# EAGLE design protection1 (EAGLE 5.11)
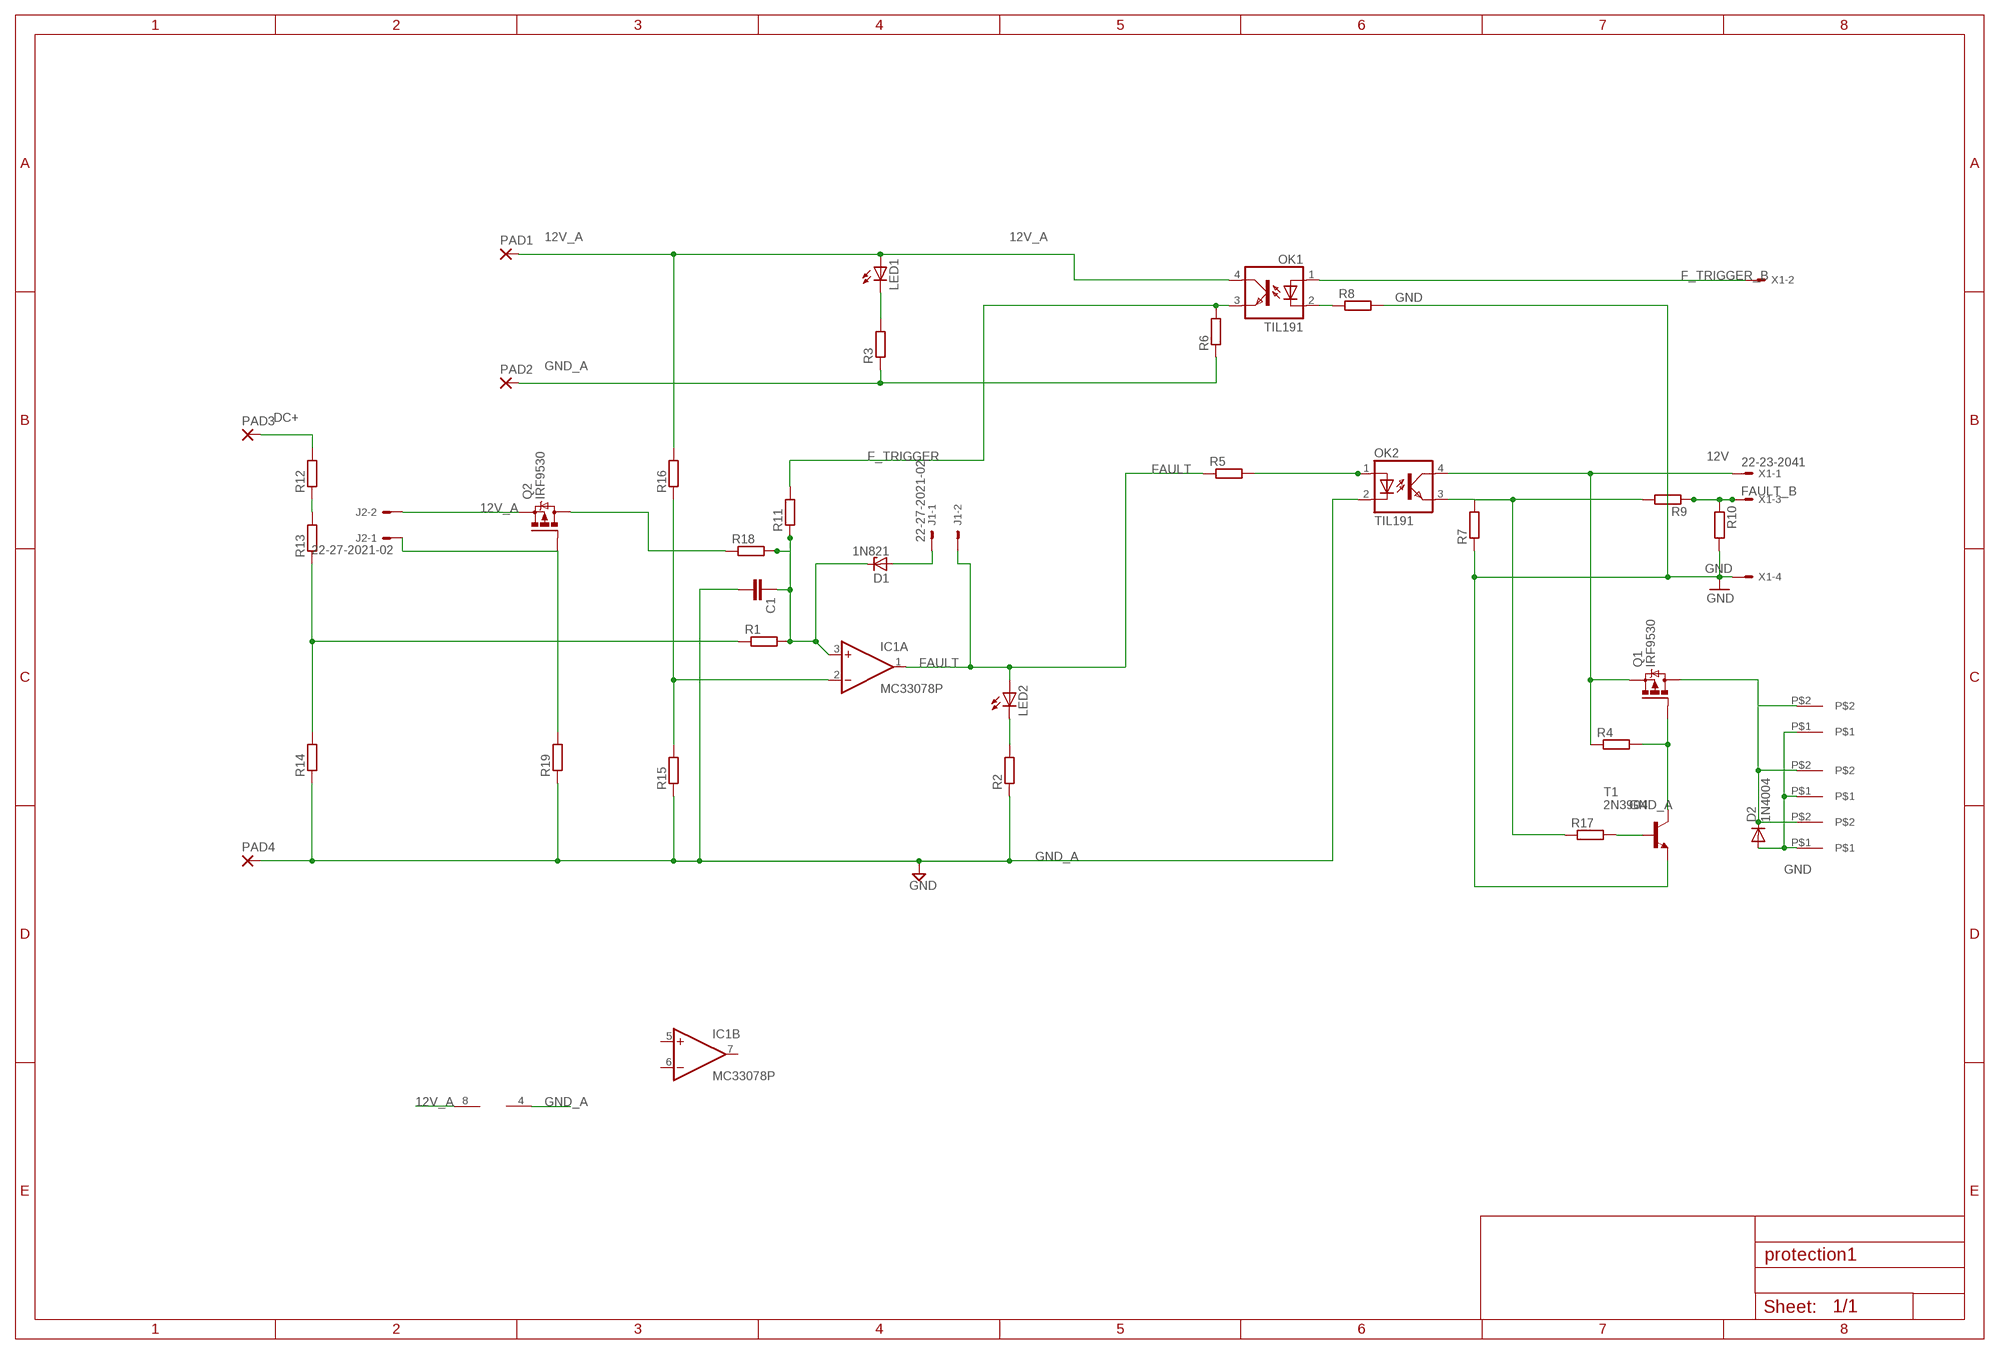
[diagram p0: schematic, sheet 1]

## Parts
C1  C2.5/2  [C2.5-2]
D1  1N821  [DO35Z10]
D2  1N4004  [DO41-10]
IC1  MC33078P  [DIL08]
J1  22-27-2021-02  [6410-02]
J2  22-27-2021-02  [6410-02]
LED1  LEDP-LCC-2  [P-LCC-2]
LED2  LEDP-LCC-2  [P-LCC-2]
OK1  TIL191  [DIL04]
OK2  TIL191  [DIL04]
PAD1  2,54/1,0  [2,54/1,0]
PAD2  2,54/1,0  [2,54/1,0]
PAD3  3,81/1,4  [3,81/1,4]
PAD4  3,81/1,4  [3,81/1,4]
Q1  IRF9530  [TO220BV]
Q2  IRF9530  [TO220BV]
R1  R-EU_0207/10  [0207/10]
R2  R-EU_0207/10  [0207/10]
R3  R-EU_0207/10  [0207/10]
R4  R-EU_0207/10  [0207/10]
R5  R-EU_0207/10  [0207/10]
R6  R-EU_0207/10  [0207/10]
R7  R-EU_0207/10  [0207/10]
R8  R-EU_0207/10  [0207/10]
R9  R-EU_0207/10  [0207/10]
R10  R-EU_0207/10  [0207/10]
R11  R-EU_0207/10  [0207/10]
R12  R-EU_0411/12  [0411/12]
R13  R-EU_0411/12  [0411/12]
R14  R-EU_0207/10  [0207/10]
R15  R-EU_0207/10  [0207/10]
R16  R-EU_0207/10  [0207/10]
R17  R-EU_0207/10  [0207/10]
R18  R-EU_0207/10  [0207/10]
R19  R-EU_0207/10  [0207/10]
T1  2N3904  [TO92]
U$1  TERMINAL_2WAY_EESTORES  [TERMINAL_2WAY_EESTORES]
U$2  TERMINAL_2WAY_EESTORES  [TERMINAL_2WAY_EESTORES]
U$3  TERMINAL_2WAY_EESTORES  [TERMINAL_2WAY_EESTORES]
X1  22-23-2041  [22-23-2041]

## Nets
12V: OK2.4(COL) Q1.S R4.1 X1.1
12V_A: IC1.8(P:V+) J2.2 LED1.A OK1.4(COL) PAD1.1(P) Q2.S R16.2
DC+: PAD3.1(P) R12.2
F_TRIGGER: OK1.3(EMIT) R6.2 R11.2
F_TRIGGER_B: OK1.1(A) X1.2
FAULT: IC1.1(A:OUT) J1.2 LED2.A R5.1
FAULT_B: OK2.3(EMIT) R7.2 R9.2 R17.1
GND: D2.A R7.1 R8.2 R10.2 T1.3(E) U$1.P$1 U$2.P$1 U$3.P$1 X1.4
GND_A: C1.2 IC1.4(P:V-) OK2.2(C) PAD2.1(P) PAD4.1(P) R2.1 R3.1 R6.1 R14.1 R15.1 R19.1 ; supply symbol labelled GND
N$1: OK2.1(A) R5.2
N$2: C1.1 D1.C IC1.3(A:+IN) R1.2 R11.1 R18.2
N$3: LED2.C R2.2
N$4: Q1.G R4.2 T1.1(C)
N$5: IC1.2(A:-IN) R15.2 R16.1
N$6: R17.2 T1.2(B)
N$7: R1.1 R13.1 R14.2
N$8: LED1.C R3.2
N$9: R12.1 R13.2
N$10: D2.C Q1.D U$1.P$2 U$2.P$2 U$3.P$2
N$11: OK1.2(C) R8.1
N$14: R9.1 R10.1 X1.3
N$15: D1.A J1.1
N$16: Q2.D R18.1
N$17: J2.1 Q2.G R19.2
Unconnected: IC1.5(B:+IN) IC1.6(B:-IN) IC1.7(B:OUT)

## Library data of the parts
C1 = capacitor-wima:C: CAPACITOR naming: grid - package width
D1 = diode:1N821: Reference DIODE temperature compensated, 6,2 V
D2 = diode:1N4004: DIODE general purpose rectifier, 1 A
IC1 = linear:MC33078: OP AMP
J1 J2 = con-molex:22-?-02: CONNECTOR wire to board 2.54 mm (.1 inch) pitch header; OC_FARNELL: unknown; OC_NEWARK: unknown
LED1 LED2 = led:LED: LED OSRAM: - CHIPLED LG R971, LG N971, LY N971, LG Q971, LY Q971, LO R971, LY R971 LH N974, LH R974 LS Q976, LO Q976, LY Q976 LO Q996 - Hyper CHIPLED LW Q18S LB Q993, LB Q99A, LB R99A - SideLED LS A670, LO A670, LY A670, LG A670, LP A670 LB A673, LV A673, LT A673, LW A673 LH A674 LY A675 LS A676, LA A676, LO A676, LY A676, LW A676 LS A679, LY A679, LG A679 - Hyper Micro SIDELED® LS Y876, LA Y876, LO Y876, LY Y876 LT Y87S - SmartLED LW L88C, LW L88S LB L89C, LB L89S, LG L890 LS L89K, LO L89K, LY L89K LS L896, LA L896, LO L896, LY L896 - TOPLED LS T670, LO T670, LY T670, LG T670, LP T670 LSG T670, LSP T670, LSY T670, LOP T670, LYG T670 LG T671, LOG T671, LSG T671 LB T673, LV T673, LT T673, LW T673 LH T674 LS T676, LA T676, LO T676, LY T676, LB T676, LH T676, LSB T676, LW T676 LB T67C, LV T67C, LT T67C, LS T67K, LO T67K, LY T67K, LW E67C LS E67B, LA E67B, LO E67B, LY E67B, LB E67C, LV E67C, LT E67C LW T67C LS T679, LY T679, LG T679 LS T770, LO T770, LY T770, LG T770, LP T770 LB T773, LV T773, LT T773, LW T773 LH T774 LS E675, LA E675, LY E675, LS T675 LS T776, LA T776, LO T776, LY T776, LB T776 LHGB T686 LT T68C, LB T68C - Hyper Mini TOPLED® LB M676 - Mini TOPLED Santana® LG M470 LS M47K, LO M47K, LY M47K Source: http://www.osram.convergy.de LUXEON: - LUMILED® LXK2-PW12-R00, LXK2-PW12-S00, LXK2-PW14-U00, LXK2-PW14-V00 LXK2-PM12-R00, LXK2-PM12-S00, LXK2-PM14-U00 LXK2-PE12-Q00, LXK2-PE12-R00, LXK2-PE12-S00, LXK2-PE14-T00, LXK2-PE14-U00 LXK2-PB12-K00, LXK2-PB12-L00, LXK2-PB12-M00, LXK2-PB14-N00, LXK2-PB14-P00, LXK2-PB14-Q00 LXK2-PR12-L00, LXK2-PR12-M00, LXK2-PR14-Q00, LXK2-PR14-R00 LXK2-PD12-Q00, LXK2-PD12-R00, LXK2-PD12-S00 LXK2-PH12-R00, LXK2-PH12-S00 LXK2-PL12-P00, LXK2-PL12-Q00, LXK2-PL12-R00 Source: www.luxeon.com KINGBRIGHT: KA-3528ASYC Source: www.kingbright.com
OK1 OK2 = optocoupler:TIL191: TEXAS INSTRUMENTS OPTO COUPLER; OC_FARNELL: 1683363; OC_NEWARK: unknown
PAD1 PAD2 = wirepad:2,54/1,0: THROUGH-HOLE PAD
PAD3 PAD4 = wirepad:3,81/1,4: THROUGH-HOLE PAD
Q1 Q2 = transistor-power:IRF9530: P-CHANNEL HEXFET POWER-MOS-FET Source: http://www.irf.com/product-info/datasheets/data/irf9530.pdf
R1-R19 = resistor:R-EU_: RESISTOR, European symbol
T1 = transistor:2N3904: NPN TRANSISTOR
U$1-U$3 = 3ygp:TERMINAL_2WAY_EESTORES
X1 = con-molex:22-23-2041: .100" (2.54mm) Center Header - 4 Pin; MF: MOLEX; MPN: 22-23-2041; OC_FARNELL: 1462920; OC_NEWARK: 38C0355

## Board
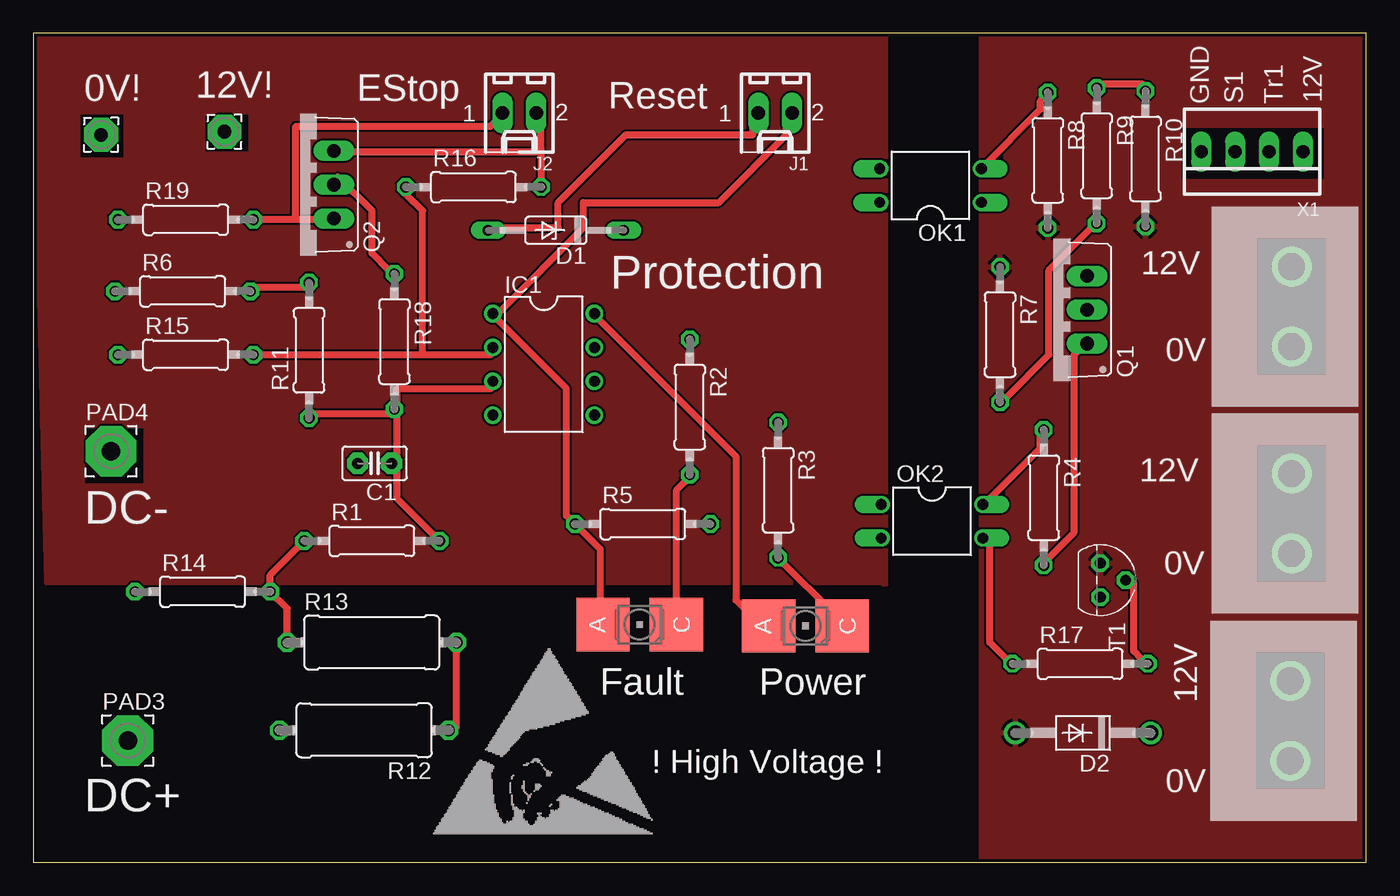
[diagram p1: board, top side]
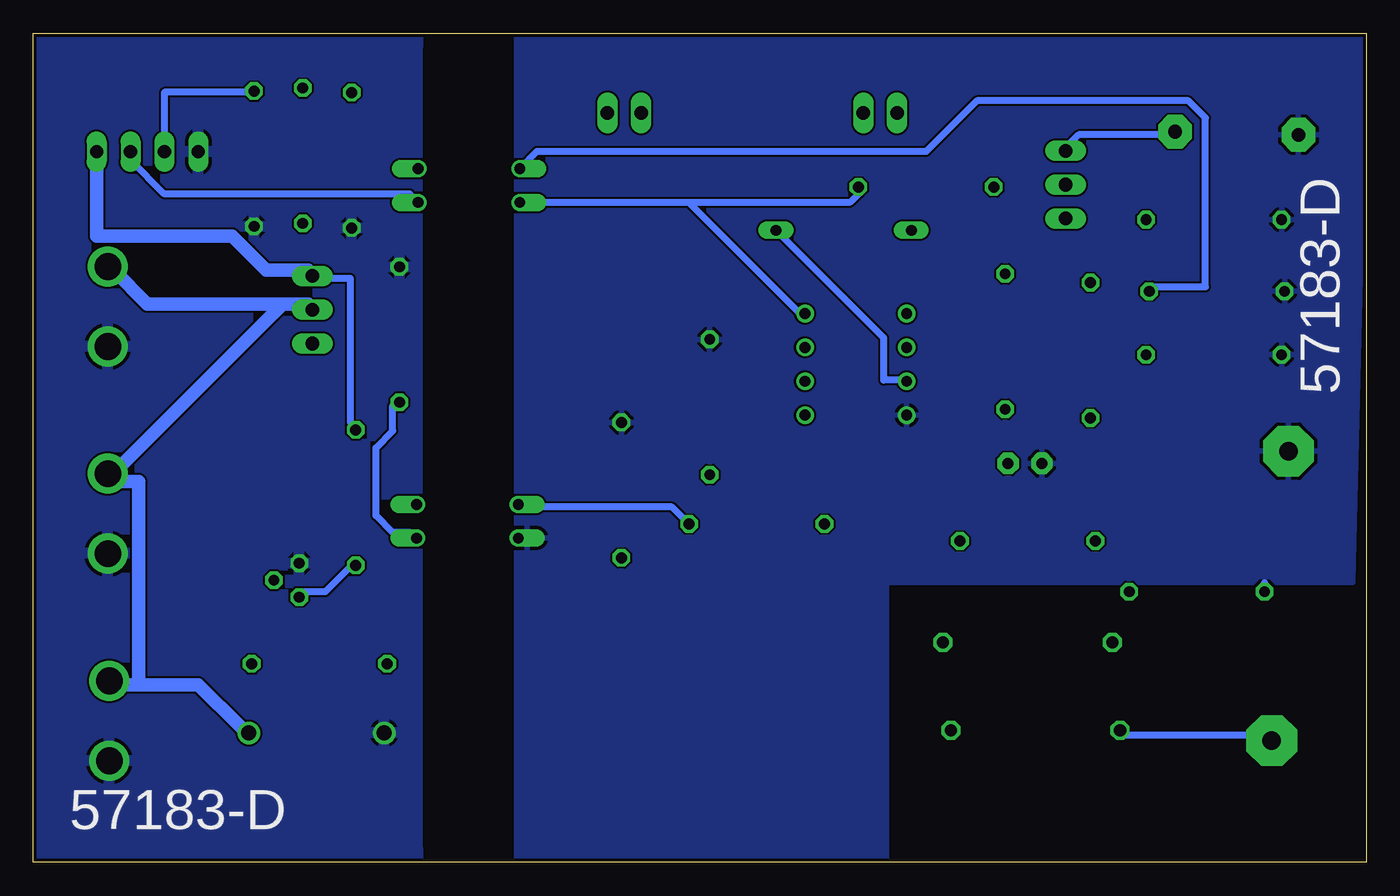
[diagram p2: board, bottom side, seen from below]

Size 100 x 62.22 mm. Coordinates in mm from the lower left corner, seen from the top.
Outline: 0,0 100,0 100,62.22 0,62.22 0,0
Copper layers (1*16): Top 0.035mm / dielectric 1.5mm / Bottom 0.035mm
Design rules: minimum track width 6mil, minimum drill 12mil, track to track 6mil, track to pad 6mil, pad to pad 6mil, via to via 6mil, smd to smd 0mil, copper to edge 10mil, drill to drill 10mil, minimum pad ring 10mil, minimum via ring 6mil, stop-mask expansion 2mil, vias tented up to drill 100mil, thermal gap 10mil
tRestrict: area 86.2,51.3 to 96.8,55.1; area 12.9,53.4 to 16.1,56.1; area 3.5,52.9 to 6.7,56.1; area 3.9,28.5 to 8.2,32.6; area 4.8,6.5 to 9.7,11.5; area 64.4,1 to 70.8,61.2
bRestrict: area 64.4,1.1 to 70.8,61.2

### Footprints (pad centres in the part's own frame; a part is rotated, then mirrored left to right if it is on the bottom)
C2.5-2 = drill 0.813 pad 1.6 octagon: 1 -1.27,0; 2 1.27,0
DO35Z10 = drill 0.813 long: A 5.08,0; C -5.08,0
DO41-10 = drill 1.118: A 5.08,0; C -5.08,0
DIL08 = drill 0.813 pad 1.27: 1 -3.81,-3.81; 2 -1.27,-3.81; 3 1.27,-3.81; 4 3.81,-3.81; 5 3.81,3.81; 6 1.27,3.81; 7 -1.27,3.81; 8 -3.81,3.81
6410-02 = drill 1.016 long: 1 1.27,0; 2 -1.27,0
P-LCC-2 = smd 4 x 4: A 0,2.75; C 0,-2.75
DIL04 = drill 0.813 offset: 1 -1.27,-3.81; 2 1.27,-3.81; 3 1.27,3.81; 4 -1.27,3.81
2,54/1,0 = drill 1.016 pad 2.54 octagon: 1 0,0
3,81/1,4 = drill 1.397 pad 3.81 octagon: 1 0,0
TO220BV = drill 1.016 long: D 0,-2.54; G -2.54,-2.54; S 2.54,-2.54
0207/10 = drill 0.813 octagon: 1 -5.08,0; 2 5.08,0
0411/12 = drill 0.914 octagon: 1 -6.35,0; 2 6.35,0
TO92 = drill 0.813 octagon: 1 1.27,0; 2 0,1.905; 3 -1.27,0
TERMINAL_2WAY_EESTORES = drill 2: P$1 -3,0; P$2 3,0
22-23-2041 = drill 1 long: 1 -3.81,0; 2 -1.27,0; 3 1.27,0; 4 3.81,0

### Placement (x,y rotation side)
C1  25.6,29.95 180 top
D1  39.2,47.43 180 top
D2  78.75,9.72 180 top
IC1  38.29,37.38 270 top
J1  55.66,56.24 180 top
J2  36.46,56.24 180 top
LED1  57.94,17.75 90 top
LED2  45.49,17.86 90 top
OK1  67.31,50.8 90 top
OK2  67.42,25.6 270 top
PAD1  14.34,54.84 0 top
PAD2  5.08,54.61 0 top
PAD3  7.09,9.14 0 top
PAD4  5.83,30.86 0 top
Q1  76.53,41.48 90 top
Q2  20,50.86 90 top
R1  25.4,24.13 0 top
R2  49.25,34.18 270 top
R3  55.88,27.94 270 top
R4  75.81,27.38 270 top
R5  45.72,25.4 0 top
R6  11.2,42.86 0 top
R7  72.53,39.61 270 top
R8  76.11,52.69 270 top
R9  79.78,53.04 270 top
R10  83.44,52.81 270 top
R11  20.69,38.43 90 top
R12  24.82,9.92 180 top
R13  25.4,16.51 0 top
R14  12.7,20.32 0 top
R15  11.43,38.1 0 top
R16  33.02,50.69 0 top
R17  78.54,14.91 0 top
R18  27.09,39.09 270 top
R19  11.43,48.23 0 top
T1  80.05,21.18 270 top
U$1  94.41,41.72 90 top
U$2  94.41,26.17 90 top
U$3  94.3,10.63 90 top
X1  91.44,53.34 180 top

### Tracks (layer width: path | path; a pad name or v marks a point on that pad's centre or on a via)
12V
  Top 0.508: OK2.4 71.75,27.3 75.56,31.11 75.56,32.38 R4.1
  Bottom 0.508: Q1.S 79.38,44.45 | 78.74,43.81 76.2,43.81 76.2,33.02 R4.1
  Bottom 1.016: X1.1 95.25,46.99 85.09,46.99 82.55,44.45 79.38,44.45 | 78.74,43.81 Q1.S
12V_A
  Top 0.508: 38.1,53.34 38.1,55.88 J2.2 | 38.1,53.34 R16.2 | LED1.A 54.61,17.78 52.7,19.68 52.7,30.48 42.55,40.64 IC1.8 | 38.1,53.34 22.86,53.34 Q2.S
  Bottom 0.508: Q2.S 22.23,53.98 21.59,54.61 14.61,54.61 PAD1.1 | 50.8,49.53 42.55,41.27 IC1.8 | 50.8,49.53 OK1.4 | 50.8,49.53 38.73,49.53 38.1,50.16 R16.2
DC+
  Bottom 0.508: R12.2 18.41,9.53 7.62,9.53 PAD3.1
F_TRIGGER
  Top 0.508: R6.2 16.51,43.18 20.32,43.18 R11.2
  Bottom 0.508: OK1.3 62.23,53.34 33.02,53.34 29.21,57.15 13.34,57.15 12.06,55.88 12.06,43.18 15.88,43.18 R6.2
F_TRIGGER_B
  Bottom 0.508: OK1.1 71.75,50.16 90.17,50.16 92.71,52.7 X1.2
FAULT
  Top 0.508: LED2.A 42.55,18.41 42.55,23.5 R5.1 40.01,26.04 40.01,35.56 34.92,40.64 IC1.1 34.92,41.27 41.27,47.62 41.27,49.53 51.44,49.53 56.52,54.61 56.52,55.88 J1.2
FAULT_B
  Top 0.508: R17.1 73.03,15.24 71.75,16.51 71.75,24.13 OK2.3 | R7.2 73.03,34.92 76.2,38.1 76.2,44.45 79.38,47.62 R9.2
  Bottom 0.508: OK2.3 71.75,24.77 73.03,24.77 74.3,26.04 74.3,31.11 73.03,32.38 73.03,34.29 R7.2
GND
  pour Top: 100.33,62.23 100.33,0 72.39,0 71.12,0 71.12,62.23
  pour Bottom: 100.33,62.23 100.33,0 71.12,0 71.12,62.23
GND_A
  Bottom 0.508: R14.1 7.62,20.95 7.62,21
  pour Bottom: 63.75,62.38 63.75,0.15 36,0 36,21 1,21 0,62.23
N$1
  Bottom 0.508: R5.2 52.07,26.67 63.5,26.67 OK2.1
N$2
  Top 0.508: R11.1 20.95,33.66 26.67,33.66 R18.2 | R18.2 27.3,33.66 27.3,30.48 C1.1 27.3,29.84 27.3,27.3 R1.2 | IC1.3 34.29,35.56 27.3,35.56 27.3,34.29 R18.2
  Bottom 0.508: D1.C 43.81,46.99 36.2,39.37 36.2,36.2 34.92,36.2 IC1.3
N$3
  Top 0.508: R2.2 48.9,28.57 48.26,27.94 48.26,18.41 LED2.C
N$4
  Top 0.508: Q1.G 78.74,38.73 78.11,38.1 78.11,24.77 76.2,22.86 R4.2
  Bottom 0.508: R4.2 76.2,22.23 78.11,20.32 80.01,20.32 T1.1
N$5
  Top 0.508: 29.21,38.1 34.29,38.1 IC1.2 | R15.2 29.21,38.1 | 29.21,38.1 29.21,48.9 27.94,50.16 R16.1
N$6
  Top 0.508: R17.2 83.19,15.24 82.55,15.88 82.55,20.95 T1.2
N$7
  Top 0.508: R13.1 19.05,19.05 R14.2 17.78,21.59 R1.1
N$8
  Top 0.508: R3.2 60.33,18.41 60.33,17.78 LED1.C
N$9
  Top 0.508: R13.2 31.75,10.16 R12.1
N$10
  Bottom 0.508: 93.98,13.34 U$3.P$2 | U$2.P$2 93.98,29.21
  Bottom 1.016: 92.08,13.34 93.98,13.34 | 92.08,13.34 87.63,13.34 84.45,10.16 D2.C | 81.28,41.91 91.44,41.91 93.98,44.45 U$1.P$2 | 81.28,41.91 79.38,41.91 Q1.D | 93.98,29.21 81.28,41.91 | 92.08,13.34 92.08,28.57 93.98,28.57 U$2.P$2
N$11
  Top 0.508: OK1.2 75.56,56.52 75.56,57.15 R8.1
N$12
  pour Top: 0,62.23 63.93,62.23 63.93,20.88 63.8,20.88 63.8,21.03 1,21
N$14
  Top 0.508: R9.1 80.01,58.42 83.19,58.42 R10.1
  Bottom 0.508: X1.3 90.17,57.78 83.82,57.78 R10.1
N$15
  Top 0.508: D1.A 34.29,47.62 39.37,47.62 39.37,49.53 44.45,54.61 53.98,54.61 53.98,55.88 J1.1
N$16
  Top 0.508: R18.1 26.67,44.45 25.4,45.72 25.4,48.9 22.86,51.44 Q2.D
N$17
  Top 0.508: 19.68,48.26 22.23,48.26 Q2.G | 19.68,48.26 16.51,48.26 R19.2 | 19.68,48.26 19.68,55.24 34.29,55.24 34.92,55.88 J2.1

### Text on the board
tNames: 0V! | 12V! | EStop | Reset | GND | S1 | Tr1 | 12V | 12V | Protection | 0V | 12V | DC- | 0V | Fault | Power | 12V | ! High Voltage ! | 0V | DC+
bNames: 57183-D | 57183-D